# Altium project SC944D.PrjPCB (part 3 of 4)

## Sheet SDEC944-xD_Ethernet.SchDoc: Ethernet
size 393 x 270 mm; CompanyName: Seccom; Address1: 521, rue du capt. François Garbit; Address2: 69440 Mornant; Address3: seccom@seccom.fr; Address4: www.seccom.fr; DocumentNumber: 6; SheetNumber: 6; SheetTotal: 22; PageSetup: Record=PageOptions|CenterHorizontal=True|CenterVertical=True|PrintScale=0.74|XCorrection=1.00|YCorrection=1.00|PrintKind=0|BorderSize=5000000|LeftOffset=0|BottomOffset=0|Orientation=2|PaperLength=1000|PaperWidth=1000|Scale=100|PaperSource=7|PrintQuality=-4|MediaType=1|DitherType=10|PaperKind=A4|PrintScaleMode=1
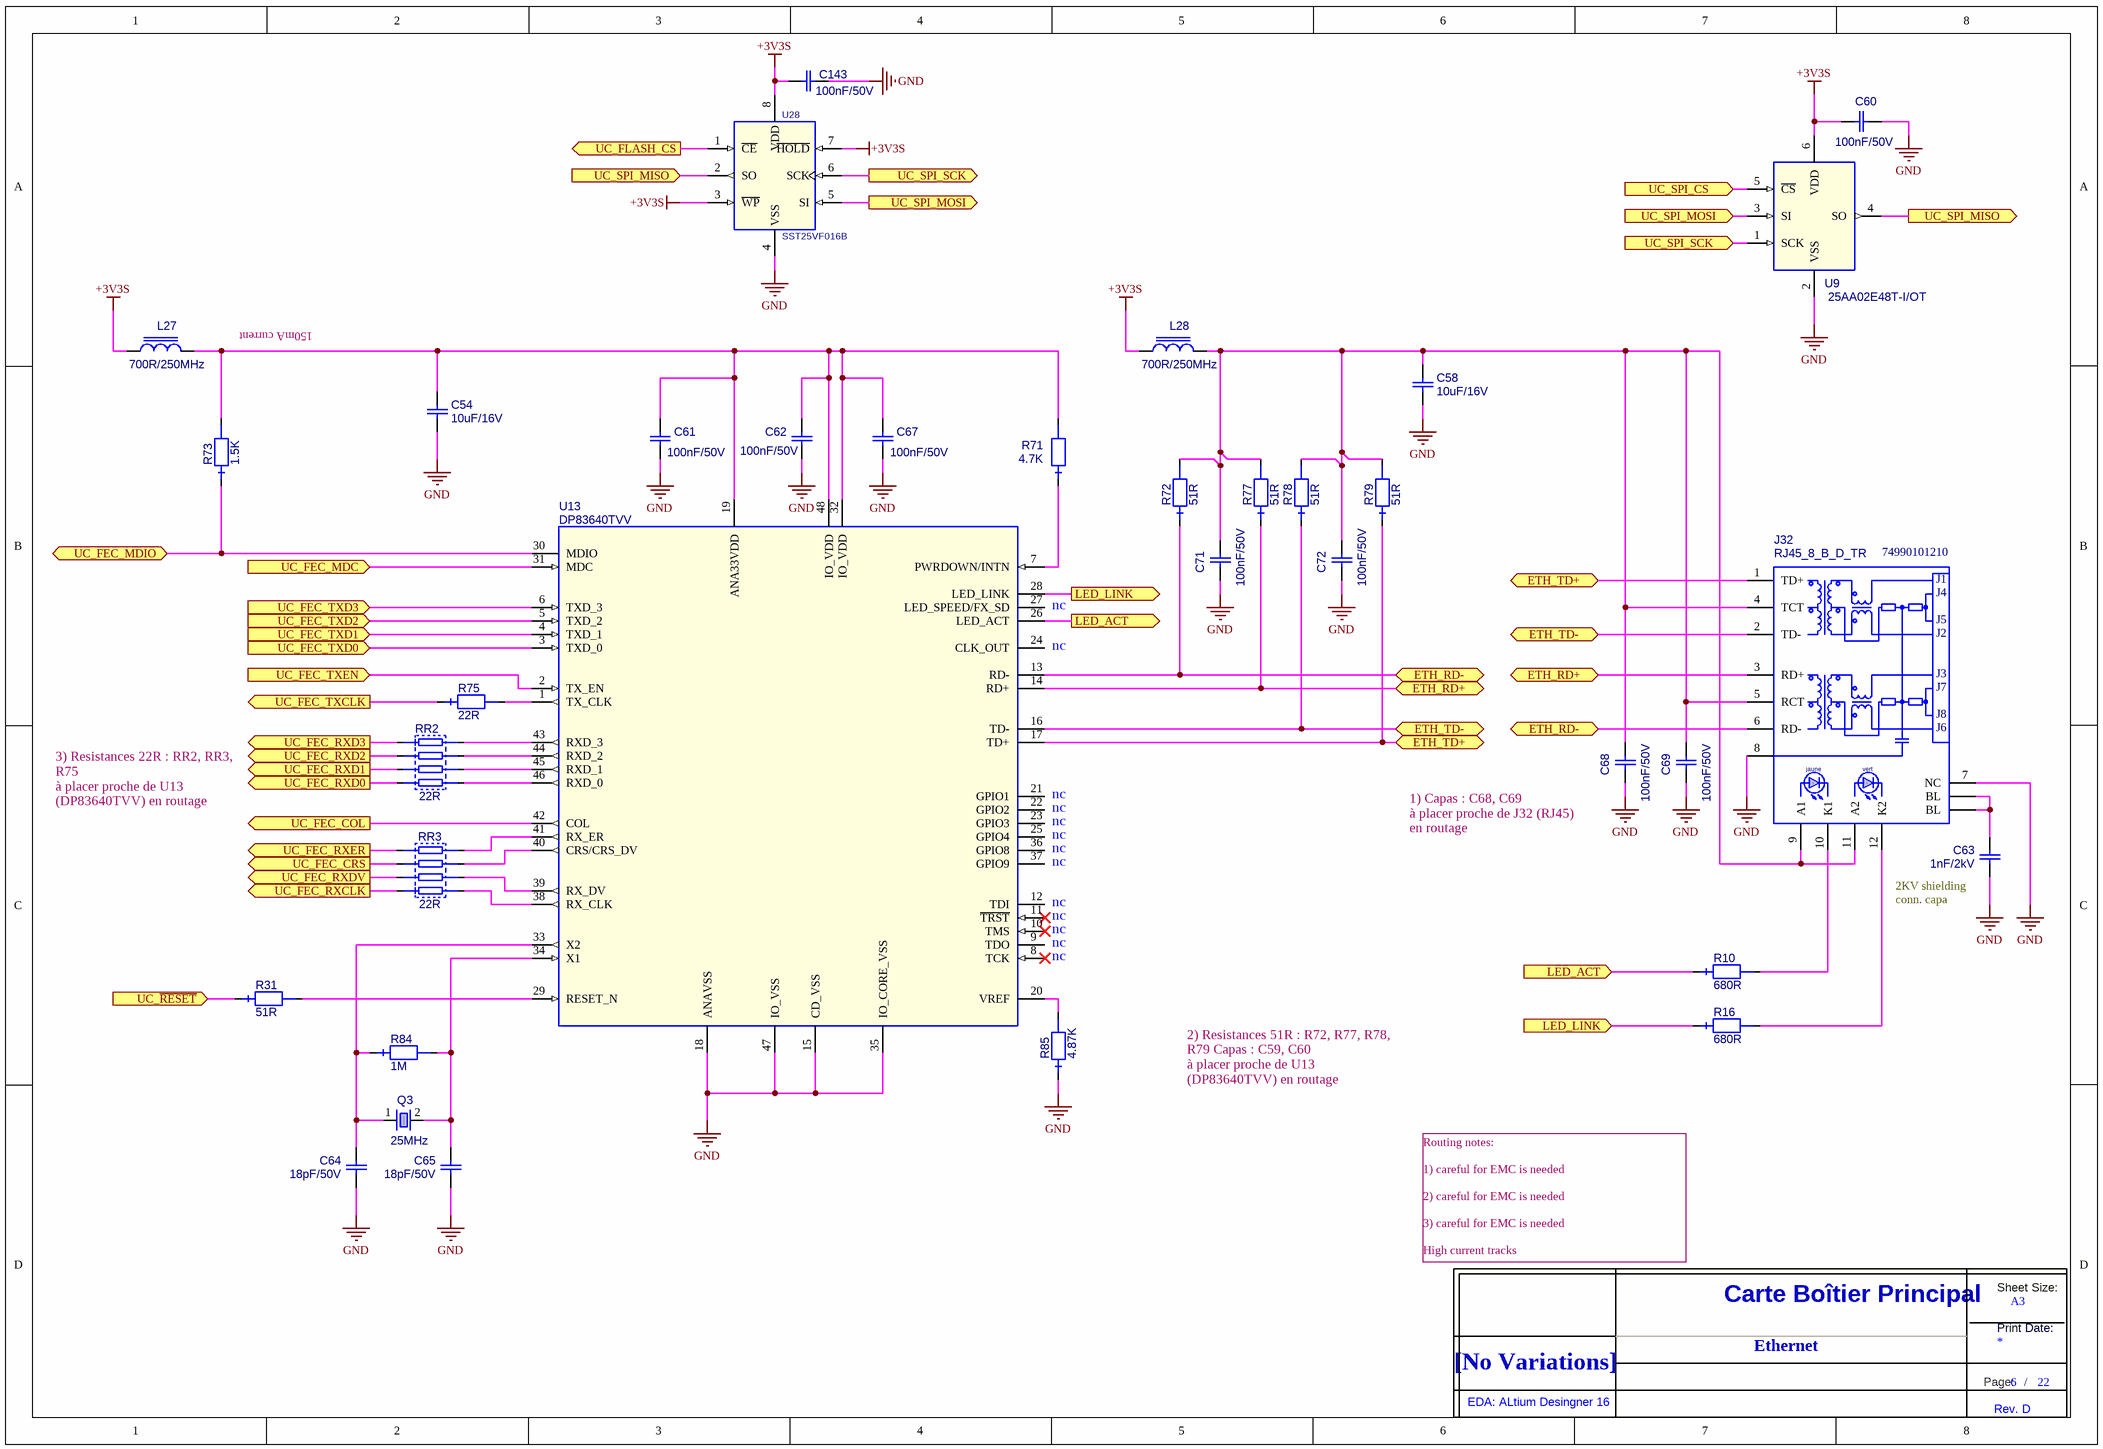
[diagram p5: SDEC944-xD_Ethernet.SchDoc]

### Parts
(Parts that share a designator on the sheet are numbered #1, #2 ... from top to bottom, then left to right.)
C54  value 10uF/16V  [0805_ReflowSoldering_CAP]  (hidden comment: C_0805_X5R_10%_10U-16V)
C58  value 10uF/16V  [0805_ReflowSoldering_CAP]  (hidden comment: C_0805_X5R_10%_10U-16V)
C60  value 100nF/50V  [0603_ReflowSoldering_CAP]  (hidden comment: C_0603_X7R_10%_100N-50V)
C61  value 100nF/50V  [0603_ReflowSoldering_CAP]  (hidden comment: C_0603_X7R_10%_100N-50V)
C62  value 100nF/50V  [0603_ReflowSoldering_CAP]  (hidden comment: C_0603_X7R_10%_100N-50V)
C63  value 1nF/2kV  [1206_ReflowSoldering_CAP]  (hidden comment: C_1206_X7R_10%_1N-2KV)
C64  value 18pF/50V  [0603_ReflowSoldering_CAP]  (hidden comment: C_0603_NPO_5%_18P-50V)
C65  value 18pF/50V  [0603_ReflowSoldering_CAP]  (hidden comment: C_0603_NPO_5%_18P-50V)
C67  value 100nF/50V  [0603_ReflowSoldering_CAP]  (hidden comment: C_0603_X7R_10%_100N-50V)
C68  value 100nF/50V  [0603_ReflowSoldering_CAP]  (hidden comment: C_0603_X7R_10%_100N-50V)
C69  value 100nF/50V  [0603_ReflowSoldering_CAP]  (hidden comment: C_0603_X7R_10%_100N-50V)
C71  value 100nF/50V  [0603_ReflowSoldering_CAP]  (hidden comment: C_0603_X7R_10%_100N-50V)
C72  value 100nF/50V  [0603_ReflowSoldering_CAP]  (hidden comment: C_0603_X7R_10%_100N-50V)
C143  value 100nF/50V  [0603_ReflowSoldering_CAP]  (hidden comment: C_0603_X7R_10%_100N-50V)
J32  value RJ45_8_B_D_TR  Ref Fab: 74990101210  [RJ45_8_B_D_TR_74990101210]  (hidden comment: PORT_ETH_10-100-BT_RJ45-8_B_D_LED_TR_74990101210)
L27  value 700R/250MHz  [0603_ReflowSoldering_CAP]  (hidden comment: IND_FERRITE_0603_742792643)
L28  value 700R/250MHz  [0603_ReflowSoldering_CAP]  (hidden comment: IND_FERRITE_0603_742792643)
Q3  value 25MHz  [QUARTZ_HC49_11.5X5_CMS]  (hidden comment: QUARTZ_HC49/4HSMX_25M)
R10  value 680R  [0603_ReflowSoldering_RES]  (hidden comment: RES_0603_1%_100PPM_680R)
R16  value 680R  [0603_ReflowSoldering_RES]  (hidden comment: RES_0603_1%_100PPM_680R)
R31  value 51R  [0603_ReflowSoldering_RES]  (hidden comment: RES_0603_1%_100PPM_51R)
R71  value 4.7K  [0603_ReflowSoldering_RES]  (hidden comment: RES_0603_1%_100PPM_4.7K)
R72  value 51R  [0603_ReflowSoldering_RES]  (hidden comment: RES_0603_1%_100PPM_51R)
R73  value 1.5K  [0603_ReflowSoldering_RES]  (hidden comment: RES_0603_1%_100PPM_1.5K)
R75  value 22R  [0603_ReflowSoldering_RES]  (hidden comment: RES_0603_1%_100PPM_22R)
R77  value 51R  [0603_ReflowSoldering_RES]  (hidden comment: RES_0603_1%_100PPM_51R)
R78  value 51R  [0603_ReflowSoldering_RES]  (hidden comment: RES_0603_1%_100PPM_51R)
R79  value 51R  [0603_ReflowSoldering_RES]  (hidden comment: RES_0603_1%_100PPM_51R)
R84  value 1M  [0603_ReflowSoldering_RES]  (hidden comment: RES_0603_1%_100PPM_1M)
R85  value 4.87K  [0603_ReflowSoldering_RES]  (hidden comment: RES_0603_1%_100PPM_4.87K)
RR2  value 22R  [ARV241]  (hidden comment: RES_4XR0603_IND_5%_22R*)
RR3  value 22R  [ARV241]  (hidden comment: RES_4XR0603_IND_5%_22R*)
Title_new#6  DNI  (value not drawn)  (graphical)
U9  25AA02E48T-I/OT  [SOT23_6L]
U13  DP83640TVV  [QFP_048_E0,50_7X7MM]
U28  value SST25VF016B  [SOIC_08_E1.27_L200_REFLOWSOLDERING]  (hidden comment: SST25VF016B-50-4I-S2AF)

### Ports
ETH_RD+ (bidir), ETH_RD- (bidir), ETH_TD+ (bidir), ETH_TD- (bidir), LED_ACT (in), LED_ACT (out), LED_LINK (in), LED_LINK (out), UC_FEC_COL (out), UC_FEC_CRS (out), UC_FEC_MDC (in), UC_FEC_MDIO (bidir), UC_FEC_RXCLK (out), UC_FEC_RXD0 (out), UC_FEC_RXD1 (out), UC_FEC_RXD2 (out), UC_FEC_RXD3 (out), UC_FEC_RXDV (out), UC_FEC_RXER (out), UC_FEC_TXCLK (out), UC_FEC_TXD0 (in), UC_FEC_TXD1 (in), UC_FEC_TXD2 (in), UC_FEC_TXD3 (in), UC_FEC_TXEN (in), UC_FLASH_CS (out), UC_SPI_CS (in), UC_SPI_MISO (in), UC_SPI_MISO (out), UC_SPI_MOSI (in), UC_SPI_MOSI (out), UC_SPI_SCK (in), UC_SPI_SCK (out), UC_~{RESET} (in)

### Nets
+3V3S: C60.1 C143.1 L27.1 L28.1 U9.6(VDD) U28.3(~{WP}) U28.7(~{HOLD}) U28.8(VDD)
GND: C54.1 C58.1 C60.2 C61.2 C62.2 C63.1 C64.1 C65.1 C67.2 C68.2 C69.2 C71.2 C72.2 C143.2 J32.7(NC) J32.8 R85.1 U9.2(VSS) U13.15(CD_VSS) U13.18(ANAVSS) U13.35(IO_CORE_VSS) U13.47(IO_VSS) U28.4(VSS)
ETH_RD+: J32.3(RD+) R77.1 U13.14(RD+) ; port ETH_RD+
ETH_RD-: J32.6(RD-) R72.1 U13.13(RD-) ; port ETH_RD-
ETH_TD+: J32.1(TD+) R79.1 U13.17(TD+) ; port ETH_TD+
ETH_TD-: J32.2(TD-) R78.1 U13.16(TD-) ; port ETH_TD-
LED_ACT: R10.1 U13.26(LED_ACT) ; port LED_ACT
LED_LINK: R16.1 U13.28(LED_LINK) ; port LED_LINK
UC_FEC_COL: U13.42(COL) ; port UC_FEC_COL
UC_FEC_CRS: RR3.5 ; port UC_FEC_CRS
UC_FEC_MDC: U13.31(MDC) ; port UC_FEC_MDC
UC_FEC_MDIO: R73.1 U13.30(MDIO) ; port UC_FEC_MDIO
UC_FEC_RXCLK: RR3.1 ; port UC_FEC_RXCLK
UC_FEC_RXD0: RR2.7 ; port UC_FEC_RXD0
UC_FEC_RXD1: RR2.5 ; port UC_FEC_RXD1
UC_FEC_RXD2: RR2.3 ; port UC_FEC_RXD2
UC_FEC_RXD3: RR2.1 ; port UC_FEC_RXD3
UC_FEC_RXDV: RR3.3 ; port UC_FEC_RXDV
UC_FEC_RXER: RR3.7 ; port UC_FEC_RXER
UC_FEC_TXCLK: R75.1 ; port UC_FEC_TXCLK
UC_FEC_TXD0: U13.3(TXD_0) ; port UC_FEC_TXD0
UC_FEC_TXD1: U13.4(TXD_1) ; port UC_FEC_TXD1
UC_FEC_TXD2: U13.5(TXD_2) ; port UC_FEC_TXD2
UC_FEC_TXD3: U13.6(TXD_3) ; port UC_FEC_TXD3
UC_FEC_TXEN: U13.2(TX_EN) ; port UC_FEC_TXEN
UC_FLASH_CS: U28.1(~{CE}) ; port UC_FLASH_CS
UC_~{RESET}: R31.1 ; port UC_~{RESET}
UC_SPI_CS: U9.5(~{CS}) ; port UC_SPI_CS
UC_SPI_MISO: U9.4(SO) U28.2(SO) ; port UC_SPI_MISO
UC_SPI_MOSI: U9.3(SI) U28.5(SI) ; port UC_SPI_MOSI
UC_SPI_SCK: U9.1(SCK) U28.6(SCK) ; port UC_SPI_SCK
NetC54_2: C54.2 C61.1 C62.1 C67.1 L27.2 R71.2 R73.2 U13.19(ANA33VDD) U13.32(IO_VDD) U13.48(IO_VDD)
NetC58_2: C58.2 C68.1 C69.1 C71.1 C72.1 J32.4(TCT) J32.5(RCT) J32.9(A1) J32.11(A2) L28.2 R72.2 R77.2 R78.2 R79.2
NetC63_2: C63.2 J32.FIX1(BL) J32.FIX2(BL)
NetC64_2: C64.2 Q3.1 R84.1 U13.33(X2)
NetC65_2: C65.2 Q3.2 R84.2 U13.34(X1)
NetJ32_10: J32.10(K1) R10.2
NetJ32_12: J32.12(K2) R16.2
NetR31_2: R31.2 U13.29(RESET_N)
NetR71_1: R71.1 U13.7(PWRDOWN/INTN)
NetR75_2: R75.2 U13.1(TX_CLK)
NetR85_2: R85.2 U13.20(VREF)
NetRR2_2: RR2.2 U13.43(RXD_3)
NetRR2_4: RR2.4 U13.44(RXD_2)
NetRR2_6: RR2.6 U13.45(RXD_1)
NetRR2_8: RR2.8 U13.46(RXD_0)
NetRR3_2: RR3.2 U13.38(RX_CLK)
NetRR3_4: RR3.4 U13.39(RX_DV)
NetRR3_6: RR3.6 U13.40(CRS/CRS_DV)
NetRR3_8: RR3.8 U13.41(RX_ER)

Not connected (* = marked no-connect by the designer): U13 8(TCK)* 9(TDO) 10(TMS)* 11(~{TRST})* 12(TDI) 21(GPIO1) 22(GPIO2) 23(GPIO3) 24(CLK_OUT) 25(GPIO4) 27(LED_SPEED/FX_SD) 36(GPIO8) 37(GPIO9)

### Notes on the sheet
- (near L27) 150mA current
- (near U13) nc
- 3) Resistances 22R : RR2, RR3, R75
  à placer proche de U13 (DP83640TVV) en routage
- (near C68) 1) Capas : C68, C69
  à placer proche de J32 (RJ45) en routage
- (near C63) 2KV shielding
  conn. capa
- 2) Resistances 51R : R72, R77, R78, R79 Capas : C59, C60
  à placer proche de U13 (DP83640TVV) en routage
- Routing notes:
  1) careful for EMC is needed
  2) careful for EMC is needed
  3) careful for EMC is needed
  High current tracks
- Ethernet
- (in symbol PORT_ETH_10-100-BT_RJ45-8_B_D_LED_TR_74990101210) J1; J4; J5; J2; J3; J7; J8; J6; jaune; vert
- (in symbol Title_new) Sheet Size:; Carte Boîtier Principal; A3; Print Date:; [No Variations]; Page:; /; EDA: ALtium Desingner 16; Rev. D

### Library data of the parts
C54 C58 = C_0805_X5R_10%_10U-16V: Condensateur céramique, X5R, 10%, CMS 0805, 10uF/16V; Creation: FB (02/10/12); Boitier: 0805; Remarque: {Remarque}; Coeff: 1; Fabricant: Kemet; Ref Fab: C0805C106K4PAC; Verification: *; ComponentLink1URL: O:\_Documentation\Datasheets\Kemet\Condos_Ceramic_CMS.pdf; ComponentLink2URL: o:\_Documentation\Datasheets\_Boitiers\PASSIF_CMS\RC_0805_(2x1,25)_(Schneider).pdf; Config: *; ComponentLink1Description: Datasheet; ComponentLink2Description: Datasheet Boitier
C60-C62 C67-C69 C71 C72 C143 = C_0603_X7R_10%_100N-50V: Condensateur céramique, X7R, 10%, CMS 0603, 100nF/50V; Creation: FB (29/02/12); Boitier: 0603; Remarque: {Remarque}; Fabricant: Kemet; Ref Fab: C0603C104K5RAC; Coeff: 1; ComponentLink1URL: O:\_Documentation\Datasheets\Kemet\Condos_Ceramic_CMS.pdf; ComponentLink2URL: o:\_Documentation\Datasheets\_BOITIERS\PASSIF_CMS\; Config: *; ComponentLink1Description: Datasheet; ComponentLink2Description: Datasheet Boitier; Supplier 1: Farnell; Supplier Part Number 1: 1288255
C63 = C_1206_X7R_10%_1N-2KV: Condensateur céramique, X7R, 10%, CMS 1206; Creation: LJ (29/06/10); Reference: 001425/00; Boitier: 1206; Remarque: {Remarque}; Coeff: 1; Fabricant: Kemet; Ref Fab: C1206C102KGRAC; ComponentLink1URL: O:\_Documentation\Datasheets\Kemet\Condos_Ceramic_HighVoltage_CMS.pdf; ComponentLink2URL: o:\_Documentation\Datasheets\_Boitiers\PASSIF_CMS\; Config: *; ComponentLink1Description: Datasheet; ComponentLink2Description: Datasheet Boitier
C64 C65 = C_0603_NPO_5%_18P-50V: Condensateur céramique, NPO, 5%, CMS 0603, 18pF/50V; Creation: FB (04/07/12); Boitier: 0603; Remarque: {Remarque}; Fabricant: Kemet; Ref Fab: C0603C180J5GAC; Coeff: 1; ComponentLink2URL: o:\_Documentation\Datasheets\_BOITIERS\PASSIF_CMS\; Config: *; ComponentLink1Description: Datasheet; ComponentLink2Description: Datasheet Boitier; Supplier 1: Farnell; Supplier Part Number 1: 1414620
J32 = PORT_ETH_10-100-BT_RJ45-8_B_D_LED_TR_74990101210: Embase RJ45 avec transformateur, 8/8 contacts + Led verte et jaune, blindée, droit, Viso 1.5kV; Creation: JPL (05/07/12); Coeff: 1; Fabricant: Wurth Electronik; Boitier: RJ45_8_B_D_TR; Config: *; ComponentLink1Description: Datasheet; ComponentLink2Description: Datasheet Boitier
L27 L28 = IND_FERRITE_0603_742792643: Inductance à ferrite multicouches CMS, imp=700R@250MHz, +/-25%, Rdc=350mR, I=400mA; Creation: PDP (02/08/12); Boitier: 0603; Coeff: 1; Fabricant: Wurth Elektronik; ComponentLink1URL: o:\_Documentation\Datasheets\Murata\Ferrite_BLM21P.pdf; Config: *; ComponentLink1Description: Datasheet; ComponentLink2Description: Datasheet Boitier; Ref Fab: 742792643; Supplier 1: Farnell; Supplier Part Number 1: 1800349
Q3 = QUARTZ_HC49/4HSMX_25M: Quartz CMS série HCM49 (équiv HC49/US), -10/+60°C, +/-30ppm, 18pF; Creation: LJ (11/03/09); Reference: 000495/00; Fabricant: Citizen; Ref Fab: HCM49 25.000MABJ-UT; Coeff: 1; Verification: *; Boitier: HC49/4HSMX; Remarque: *; ComponentLink1URL: O:\_Documentation\Datasheets\Citizen\Quartz_HC49-US_HCM49.pdf; ComponentLink2URL: o:\_Documentation\Datasheets\_BOITIERS\; Config: *; ComponentLink1Description: Datasheet; ComponentLink2Description: Datasheet Boitier; Supplier 1: Farnell; Supplier 2: Mouser; Supplier Part Number 1: 1457105; Supplier Part Number 2: 695-HCM49-25-U
R10 R16 = RES_0603_1%_100PPM_680R: Résistance, 0.100W, 1%, 100ppm, 75V, 680R; Creation: FB (02/08/12); Boitier: 0603; Remarque: {Remarque}; Fabricant: Vishay; Ref Fab: CRCW0603680RFKEA; Coeff: 1; Verification: *; ComponentLink1URL: O:\_Documentation\Datasheets\Vishay\Resistances_D-CRCWe3.pdf; ComponentLink2URL: o:\_Documentation\Datasheets\_BOITIERS\PASSIF_CMS\; Config: *; ComponentLink1Description: Datasheet; ComponentLink2Description: Datasheet Boitier; Supplier 1: Farnell; Supplier Part Number 1: 1469834; Supplier 2: Mouser; Supplier Part Number 2: 71-CRCW0603-680-E3
R31 R72 R77-R79 = RES_0603_1%_100PPM_51R: Résistance, 0.100W, 1%, 100ppm, 75V, 51R; Creation: JPL (05/07/12); Boitier: 0603; Remarque: {Remarque}; Fabricant: Vishay; Ref Fab: CRCW060351R0FKEA; Coeff: 1; Verification: *; ComponentLink1URL: O:\_Documentation\Datasheets\Vishay\Resistances_D-CRCWe3.pdf; ComponentLink2URL: o:\_Documentation\Datasheets\_BOITIERS\PASSIF_CMS\; Config: *; ComponentLink1Description: Datasheet; ComponentLink2Description: Datasheet Boitier; Supplier 1: Farnell; Supplier 2: Mouser; Supplier Part Number 1: 1652889; Supplier Part Number 2: 71-CRCW0603-51-E3
R71 = RES_0603_1%_100PPM_4.7K: Résistance, 0.100W, 1%, 100ppm, 75V, 4.7K; Creation: JPL (05/07/12); Boitier: 0603; Remarque: {Remarque}; Fabricant: Vishay; Ref Fab: CRCW06034K70FKEA; Coeff: 1; Verification: *; ComponentLink1URL: O:\_Documentation\Datasheets\Vishay\Resistances_D-CRCWe3.pdf; ComponentLink2URL: o:\_Documentation\Datasheets\_BOITIERS\PASSIF_CMS\; Config: *; ComponentLink1Description: Datasheet; ComponentLink2Description: Datasheet Boitier; Supplier 1: Farnell; Supplier 2: RadioSpares; Supplier Part Number 1: 1469807; Supplier Part Number 2: 6790484
R73 = RES_0603_1%_100PPM_1.5K: Résistance, 0.100W, 1%, 100ppm, 75V, 1.5K; Creation: JPL (05/07/12); Boitier: 0603; Remarque: {Remarque}; Fabricant: Vishay; Ref Fab: CRCW06031K50FKEA; Coeff: 1; Verification: *; ComponentLink1URL: O:\_Documentation\Datasheets\Vishay\Resistances_D-CRCWe3.pdf; ComponentLink2URL: o:\_Documentation\Datasheets\_BOITIERS\PASSIF_CMS\; Config: *; ComponentLink1Description: Datasheet; ComponentLink2Description: Datasheet Boitier; Supplier 1: Farnell; Supplier 2: RadioSpares; Supplier Part Number 1: 1469743; Supplier Part Number 2: 6789908
R75 = RES_0603_1%_100PPM_22R: Résistance, 0.100W, 1%, 100ppm, 75V, 22R; Creation: FB (05/07/12); Boitier: 0603; Remarque: {Remarque}; Fabricant: Vishay; Ref Fab: CRCW060322R0FKEA; Coeff: 1; Verification: *; ComponentLink1URL: O:\_Documentation\Datasheets\Vishay\Resistances_D-CRCWe3.pdf; ComponentLink2URL: o:\_Documentation\Datasheets\_BOITIERS\PASSIF_CMS\; Config: *; ComponentLink1Description: Datasheet; ComponentLink2Description: Datasheet Boitier; Supplier 1: Farnell; Supplier Part Number 1: 1469781
R84 = RES_0603_1%_100PPM_1M: Résistance, 0.100W, 1%, 100ppm, 75V, 1M; Creation: FB (04/07/12); Boitier: 0603; Remarque: {Remarque}; Fabricant: Vishay; Ref Fab: CRCW06031M00FKEA; Coeff: 1; Verification: *; ComponentLink1URL: O:\_Documentation\Datasheets\Vishay\Resistances_D-CRCWe3.pdf; ComponentLink2URL: o:\_Documentation\Datasheets\_BOITIERS\PASSIF_CMS\; Config: *; ComponentLink1Description: Datasheet; ComponentLink2Description: Datasheet Boitier; Supplier 1: Farnell; Supplier Part Number 1: 1469746
R85 = RES_0603_1%_100PPM_4.87K: Résistance, 0.100W, 1%, 100ppm, 75V, 4.87K; Creation: JPL (05/07/12); Boitier: 0603; Remarque: {Remarque}; Fabricant: Vishay; Ref Fab: CRCW06034K87FKEA; Coeff: 1; Verification: *; ComponentLink1URL: O:\_Documentation\Datasheets\Vishay\Resistances_D-CRCWe3.pdf; ComponentLink2URL: o:\_Documentation\Datasheets\_BOITIERS\PASSIF_CMS\; Config: *; ComponentLink1Description: Datasheet; ComponentLink2Description: Datasheet Boitier; Supplier 1: Farnell; Supplier 2: RadioSpares; Supplier Part Number 1: 1692529; Supplier Part Number 2: 6790481
RR2 RR3 = RES_4XR0603_IND_5%_22R*: Réseau de 4 résistances 0603 individuels, 63mW, 5%, CONCAVE / CONVEXE, CMS 1206; Creation: CHD; Reference: 001805/00; Boitier: ARx241; Remarque: {Remarque}; Verification: LJ (07/02/12); Coeff: 1; Fabricant: Yageo; Ref Fab: YC164-JR-0722RL; ComponentLink1URL: o:\_Documentation\Datasheets\Phycomp\ARC-ARV241-242.PDF; ComponentLink2URL: o:\_Documentation\Datasheets\_BOITIERS\; Config: *; ComponentLink1Description: Datasheet; ComponentLink2Description: Datasheet Boitier; Supplier 1: Farnell; Supplier Part Number 1: 9234411
Title_new#6 = Title_new
U9 = 25AA02E48T-I/OT: EEPROM, avec identifiant EUI-48 (adresse MAC), 2kbits, Vs=1.8~5.5V, 10MHz, CMS; Creation: CHD(10/03/09); Verification: LJ; Reference: 000492/00; Coeff: 1; Fabricant: Microchip; Boitier: SOT23_6L; Remarque: *; ComponentLink1URL: o:\_Documentation\Datasheets\MicroChip\25AA02E48.pdf; ComponentLink2URL: o:\_Documentation\Datasheets\_Boitiers\ACTIF_CMS\SOT & TSOT\SOT23_6_(Schneider).pdf; Config: *; ComponentLink1Description: Datasheet; ComponentLink2Description: Datasheet Boitier; Ref Fab: 25AA02E48T-I/OT; Value: 25AA02E48T-I/OT
U13 = DP83640TVV: DP83640 Precision PHYTER - IEEE 1588 Precision Time Protocol Transceiver; Creation: FB (05/07/12); Boitier: LQFP48_e0.50_7x7mm; Remarque: {Remarque}; Coeff: 1; Fabricant: National Semiconductor; Ref Fab: DP83640TVV; ComponentLink1Description: Datasheet; ComponentLink1URL: o:\_Documentation\Datasheets\; ComponentLink2Description: Datasheet Boitier; ComponentLink2URL: o:\_Documentation\Datasheets\_BOITIERS\; Supplier 1: Farnell; Supplier Part Number 1: 1850292; Value: DP83640TVV
U28 = SST25VF016B-50-4I-S2AF: Mémoire Flash SPI, 2MBit, 50MHz, Vs=2.7~3.6V, -40/+85°C, CMS; Creation: PDP (23/04/13); Boitier: SO8_L200; Coeff: 1; Fabricant: Microchip; Verification: *; ComponentLink1URL: O:\_Documentation\Datasheets\MicroChip\SST25VF016B.pdf; ComponentLink2URL: O:\_Documentation\Datasheets\MicroChip\SST25VF016B.pdf; ComponentLink1Description: Datasheet; ComponentLink2Description: Datasheet Boitier; Ref Fab: SST25VF016B-50-4I-S2AF; Supplier 1: Farnell; Supplier Part Number 1: 1368695; Supplier 2: Mouser; Supplier Part Number 2: 579-25VF016B5IS2AF

## Sheet SDEC944-xD_Liaison_IHM.SchDoc: Liaison IHM
size 393 x 270 mm; CompanyName: Seccom; Address1: 521, rue du capt. François Garbit; Address2: 69440 Mornant; Address3: seccom@seccom.fr; Address4: www.seccom.fr; DocumentNumber: 8; SheetNumber: 8; SheetTotal: 22; PageSetup: Record=PageOptions|CenterHorizontal=True|CenterVertical=True|PrintScale=0.74|XCorrection=1.00|YCorrection=1.00|PrintKind=0|BorderSize=5000000|LeftOffset=0|BottomOffset=0|Orientation=2|PaperLength=1000|PaperWidth=1000|Scale=100|PaperSource=7|PrintQuality=-4|MediaType=1|DitherType=10|PaperKind=A4|PrintScaleMode=1
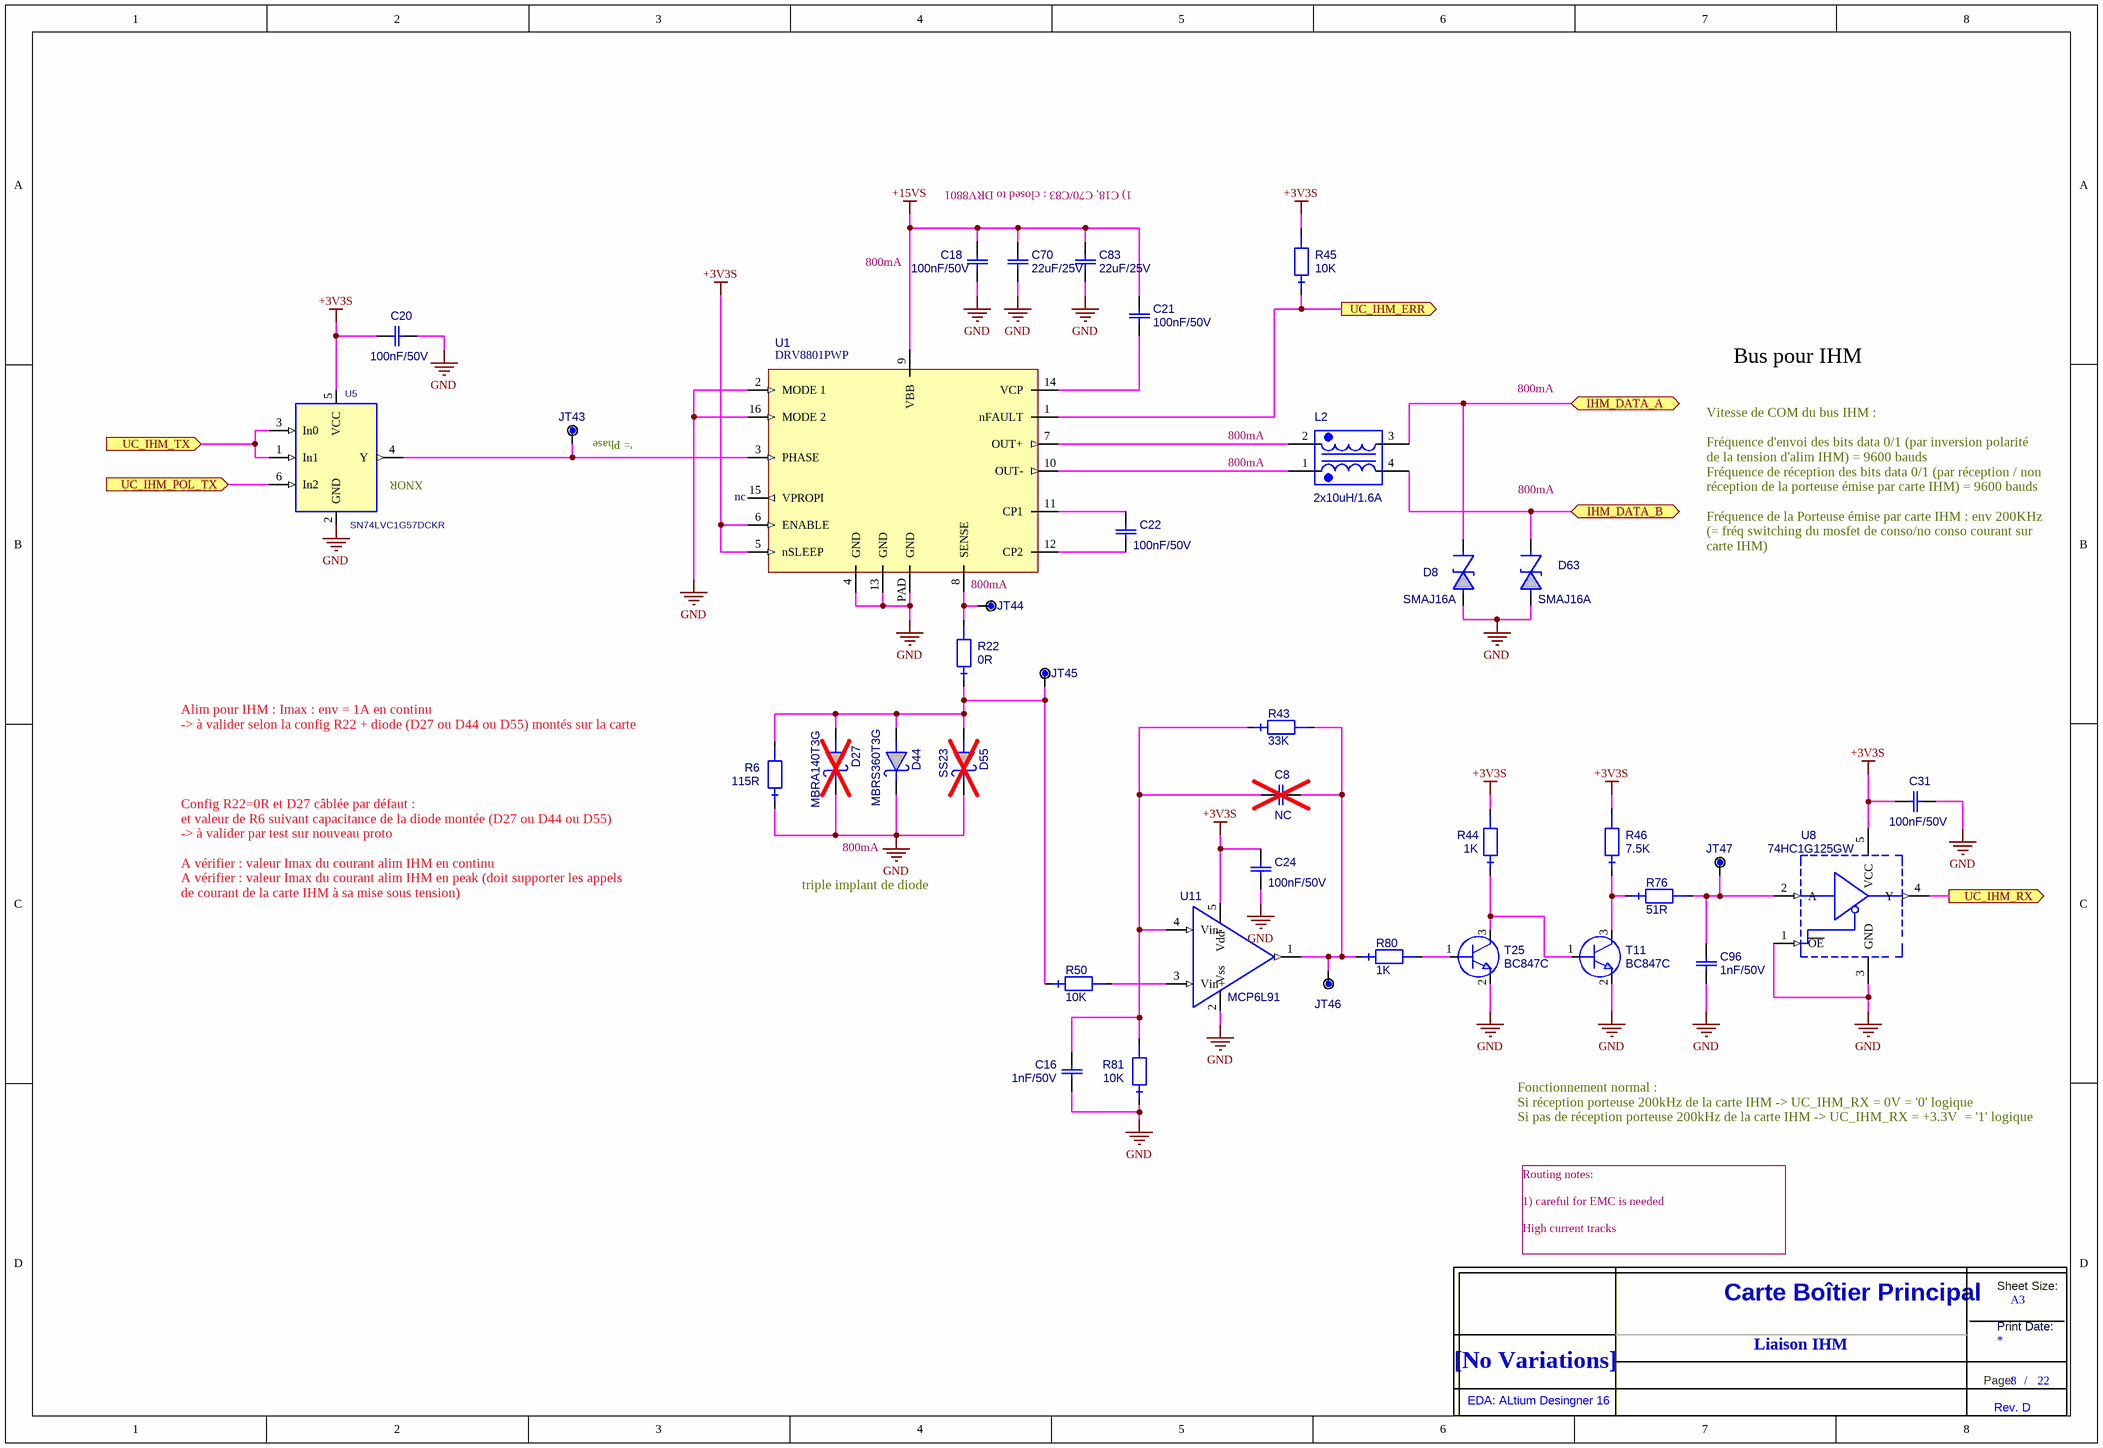
[diagram p6: SDEC944-xD_Liaison_IHM.SchDoc]

### Parts
(Parts that share a designator on the sheet are numbered #1, #2 ... from top to bottom, then left to right.)
C8  value NC  [0603_ReflowSoldering_CAP]  (hidden comment: C_0603_NC)  (no BOM)
C16  value 1nF/50V  [0603_ReflowSoldering_CAP]  (hidden comment: C_0603_NPO_5%_1N-50V)
C18  value 100nF/50V  [0603_ReflowSoldering_CAP]  (hidden comment: C_0603_X7R_10%_100N-50V)
C20  value 100nF/50V  [0603_ReflowSoldering_CAP]  (hidden comment: C_0603_X7R_10%_100N-50V)
C21  value 100nF/50V  [0603_ReflowSoldering_CAP]  (hidden comment: C_0603_X7R_10%_100N-50V)
C22  value 100nF/50V  [0603_ReflowSoldering_CAP]  (hidden comment: C_0603_X7R_10%_100N-50V)
C24  value 100nF/50V  [0603_ReflowSoldering_CAP]  (hidden comment: C_0603_X7R_10%_100N-50V)
C31  value 100nF/50V  [0603_ReflowSoldering_CAP]  (hidden comment: C_0603_X7R_10%_100N-50V)
C70  value 22uF/25V  [1206_ReflowSoldering_CAP]  (hidden comment: C_1206_X5R_20%_22U-25V)
C83  value 22uF/25V  [1206_ReflowSoldering_CAP]  (hidden comment: C_1206_X5R_20%_22U-25V)
C96  value 1nF/50V  [0603_ReflowSoldering_CAP]  (hidden comment: C_0603_NPO_5%_1N-50V)
D8  SMAJ16A  [DO214AC-SMA-P_ReflowSoldering]
D27  MBRA140T3G  [DO214AC-SMA-P_ReflowSoldering]  (no BOM)
D44  MBRS360T3G  [DO214AB-SMC-P_ReflowSoldering]
D55  SS23  [DO214AA-SMB-P_ReflowSoldering]  (no BOM)
D63  SMAJ16A  [DO214AC-SMA-P_ReflowSoldering]
JT43  POINT_TEST_PAD_40MIL  [PAD_CL5_E40X40Y17D]  (value not drawn)  (no BOM)
JT44  POINT_TEST_PAD_40MIL  [PAD_CL5_E40X40Y17D]  (value not drawn)  (no BOM)
JT45  POINT_TEST_PAD_40MIL  [PAD_CL5_E40X40Y17D]  (value not drawn)  (no BOM)
JT46  POINT_TEST_PAD_40MIL  [PAD_CL5_E40X40Y17D]  (value not drawn)  (no BOM)
JT47  POINT_TEST_PAD_40MIL  [PAD_CL5_E40X40Y17D]  (value not drawn)  (no BOM)
L2  value 2x10uH/1.6A  [SELF_WE-SL2_9.2x6]  (hidden comment: IND_FERRITE_WE-SL2_2X10UH)
R6  value 115R  [0603_ReflowSoldering_RES]  (hidden comment: RES_0603_1%_100PPM_115R)
R22  value 0R  [0603_ReflowSoldering_RES]  (hidden comment: RES_0603_1%_100PPM_0R)
R43  value 33K  [0603_ReflowSoldering_RES]  (hidden comment: RES_0603_1%_100PPM_33K)
R44  value 1K  [0603_ReflowSoldering_RES]  (hidden comment: RES_0603_1%_100PPM_1K)
R45  value 10K  [0603_ReflowSoldering_RES]  (hidden comment: RES_0603_1%_100PPM_10K)
R46  value 7.5K  [0603_ReflowSoldering_RES]  (hidden comment: RES_0603_1%_100PPM_7.5K)
R50  value 10K  [0603_ReflowSoldering_RES]  (hidden comment: RES_0603_1%_100PPM_10K)
R76  value 51R  [0603_ReflowSoldering_RES]  (hidden comment: RES_0603_1%_100PPM_51R)
R80  value 1K  [0603_ReflowSoldering_RES]  (hidden comment: RES_0603_1%_100PPM_1K)
R81  value 10K  [0603_ReflowSoldering_RES]  (hidden comment: RES_0603_1%_100PPM_10K)
T11  BC847C  [SOT23_3L_ReflowSoldering]
T25  BC847C  [SOT23_3L_ReflowSoldering]
Title_new#7  DNI  (value not drawn)  (graphical)
U1  DRV8801PWP  [HTSSOP_016_E0,65_L4,4MM_PWP]
U5  value SN74LVC1G57DCKR  [SC70_6]  (hidden comment: 74LVC1G57DCKR)
U8  74HC1G125GW  [SOT353]
U11  value MCP6L91  [SOT23_5L]  (hidden comment: MCP6L91T-E/OT)

### Ports
IHM_DATA_A (bidir), IHM_DATA_B (bidir), UC_IHM_ERR (out), UC_IHM_POL_TX (in), UC_IHM_RX (out), UC_IHM_TX (in)

### Nets
+3V3S: C20.1 C24.1 C31.1 R44.2 R45.2 R46.2 U1.5(nSLEEP) U1.6(ENABLE) U5.5(VCC) U8.5(VCC) U11.5(Vdd)
+15VS: C18.1 C21.1 C70.2 C83.2 U1.9(VBB)
GND: C16.1 C18.2 C20.2 C24.2 C31.2 C70.1 C83.1 C96.1 D8.A D27.K D44.K D55.K D63.A R6.1 R81.1 T11.2(E) T25.2(E) U1.2(MODE_1) U1.4(GND) U1.13(GND) U1.16(MODE_2) U1.PAD(GND) U5.2(GND) U8.1 U8.3(GND) U11.2(Vss)
IHM_DATA_A: D8.K L2.3 ; port IHM_DATA_A
IHM_DATA_B: D63.K L2.4 ; port IHM_DATA_B
UC_IHM_ERR: R45.1 U1.1(nFAULT) ; port UC_IHM_ERR
UC_IHM_POL_TX: U5.6(In2) ; port UC_IHM_POL_TX
UC_IHM_RX: U8.4(Y) ; port UC_IHM_RX
UC_IHM_TX: U5.1(In1) U5.3(In0) ; port UC_IHM_TX
NetC8_1: C8.1 JT46.1 R43.2 R80.1 U11.1(OUTPUT)
NetC8_2: C8.2 C16.2 R43.1 R81.2 U11.4(Vin-)
NetC21_2: C21.2 U1.14(VCP)
NetC22_1: C22.1 U1.11(CP1)
NetC22_2: C22.2 U1.12(CP2)
NetC96_2: C96.2 JT47.1 R76.2 U8.2(A)
NetD27_A: D27.A D44.A D55.A JT45.1 R6.2 R22.1 R50.1
NetJT43_1: JT43.1 U1.3(PHASE) U5.4(Y)
NetJT44_1: JT44.1 R22.2 U1.8(SENSE)
NetL2_1: L2.1 U1.10(OUT-)
NetL2_2: L2.2 U1.7(OUT+)
NetR44_1: R44.1 T11.1(B) T25.3(C)
NetR46_1: R46.1 R76.1 T11.3(C)
NetR50_2: R50.2 U11.3(Vin+)
NetR80_2: R80.2 T25.1(B)

Not connected (* = marked no-connect by the designer): U1 15(VPROPI)

### Notes on the sheet
- 1) C18, C70/C83 : closed to DRV8801
- 800mA
- Bus pour IHM
- (near JT43) '= Phase
- (near U5) XNOR
- (near U1) nc
- Vitesse de COM du bus IHM :
  Fréquence d'envoi des bits data 0/1 (par inversion polarité de la tension d'alim IHM) = 9600 bauds
  Fréquence de réception des bits data 0/1 (par réception / non réception de la porteuse émise par carte IHM) = 9600 bauds
  Fréquence de la Porteuse émise par carte IHM : env 200KHz (= fréq switching du mosfet de conso/no conso courant sur carte IHM)
- Alim pour IHM : Imax : env = 1A en continu
  -> à valider selon la config R22 + diode (D27 ou D44 ou D55) montés sur la carte
- Config R22=0R et D27 câblée par défaut :
  et valeur de R6 suivant capacitance de la diode montée (D27 ou D44 ou D55)
  -> à valider par test sur nouveau proto
  A vérifier : valeur Imax du courant alim IHM en continu
  A vérifier : valeur Imax du courant alim IHM en peak (doit supporter les appels de courant de la carte IHM à sa mise sous tension)
- triple implant de diode
- Fonctionnement normal :
  Si réception porteuse 200kHz de la carte IHM -> UC_IHM_RX = 0V = '0' logique
  Si pas de réception porteuse 200kHz de la carte IHM -> UC_IHM_RX = +3.3V  = '1' logique
- Routing notes:
  1) careful for EMC is needed
  High current tracks
- Liaison IHM
- (in symbol Title_new) Sheet Size:; Carte Boîtier Principal; A3; Print Date:; [No Variations]; Page:; /; EDA: ALtium Desingner 16; Rev. D

### Library data of the parts
C8 = C_0603_NC: Condensateur, CMS 0603, NC; Creation: PDP (30/08/12); Boitier: 0603; Coeff: 1; ComponentLink2URL: o:\_Documentation\Datasheets\_BOITIERS\PASSIF_CMS\; ComponentLink2Description: Datasheet Boitier
C16 C96 = C_0603_NPO_5%_1N-50V: Condensateur céramique, NPO, 5%, CMS 0603; Creation: LJ; Reference: 001809/00; Boitier: 0603; Remarque: {Remarque}; Coeff: 1; Fabricant: AVX; Ref Fab: 06035A102JAT2A; ComponentLink1URL: o:\_Documentation\Datasheets\BC_Components\Condo_CMS_NPO-X7R-Y5V.pdf; ComponentLink2URL: o:\_Documentation\Datasheets\_BOITIERS\PASSIF_CMS\; Config: *; ComponentLink1Description: Datasheet; ComponentLink2Description: Datasheet Boitier; Supplier 1: Mouser; Supplier Part Number 1: 581-06035A102J
C18 C20-C22 C24 C31 = C_0603_X7R_10%_100N-50V: as C60 on sheet SDEC944-xD_Ethernet; ComponentLink1URL: O:\_Documentation\Datasheets\Kemet\Condos_Ceramic_CMS.pdf; ComponentLink2URL: o:\_Documentation\Datasheets\_BOITIERS\PASSIF_CMS\; Config: *; ComponentLink1Description: Datasheet; ComponentLink2Description: Datasheet Boitier; Supplier 1: Farnell; Supplier Part Number 1: 1288255
C70 C83 = C_1206_X5R_20%_22U-25V: Condensateur céramique, X5R, 20%, CMS 1206, 22uF/25V; Creation: ZA (18/12/13); Reference: /01; Boitier: 1206; Remarque: {Remarque}; Fabricant: TDK; Coeff: 1; Ref Fab: C3216X5R1E226M160AB; Verification: *; ComponentLink1URL: O:\_Documentation\Datasheets\TDK\general_B11.pdf; ComponentLink2URL: o:\_Documentation\Datasheets\_BOITIERS\PASSIF_CMS\; ComponentLink1Description: Datasheet; ComponentLink2Description: Datasheet Boitier; Supplier 1: Farnell; Supplier Part Number 1: 2354129; Supplier 2: Mouser; Supplier Part Number 2: 810-C3216X5R1E226M
D8 D63 = SMAJ16A: Diode Transil/TVS unidirectionnelle (A), Transzorb, 400W, 16V, CMS; Creation: ZA (29/07/13); Boitier: DO214AC/SMA; Remarque: {Remarque}; Coeff: 1; Fabricant: Bourns; ComponentLink1URL: o:\_Documentation\Datasheets\Bourns\SMAJ-74970.pdf; ComponentLink2URL: o:\_Documentation\Datasheets\_BOITIERS\ACTIF_CMS\SMx\SMB_(Schneider).lnk; Config: *; ComponentLink1Description: Datasheet; ComponentLink2Description: Datasheet Boitier; Ref Fab: SMAJ16A; Supplier 1: Farnell; Supplier Part Number 1: 1843352; Supplier 2: Mouser; Supplier Part Number 2: 652-SMAJ16A; Value: SMAJ16A
D27 = MBRA140T3G: Diode Schottky, Vrrm=40V, If=1A, Vf=0.55V@1A, CMS; Creation: PDP (31/08/12); Boitier: DO214AC/SMA; Fabricant: ON Semiconductor; Coeff: 1; Ref Fab: MBRA140T3G; ComponentLink1URL: O:\_Documentation\Datasheets\ON_Semiconductors\MBRA140T3-D.PDF; ComponentLink2URL: O:\_Documentation\Datasheets\ON_Semiconductors\MBRA140T3-D.PDF; Config: *; ComponentLink1Description: Datasheet; ComponentLink2Description: Datasheet Boitier; Supplier 1: Farnell; Supplier Part Number 1: 9555986; Supplier 2: Mouser; Supplier Part Number 2: 863-MBRA140T3G; Value: MBRA140T3G
D44 = MBRS360T3G: Diode Schottky, Vrrm=60V, If=3A, Vf=0.74V, -65 à +175°C, CMS; Creation: ZA (16/04/13); Boitier: DO214AB/SMC; Fabricant: ON Semiconductor; Coeff: 1; Ref Fab: MBRS360T3G; ComponentLink1URL: O:\_Documentation\Datasheets\ON_Semiconductors\MBRS360T3G_NRVBS360T3G.PDF; ComponentLink2URL: O:\_Documentation\Datasheets\ON_Semiconductors\MBRS360T3G_NRVBS360T3G.PDF; Config: *; ComponentLink1Description: Datasheet; ComponentLink2Description: Datasheet Boitier; Supplier 1: Farnell; Supplier Part Number 1: 9556940; Supplier 2: Mouser; Supplier Part Number 2: 863-MBRS360T3G; Value: MBRS360T3G
D55 = SS23: Diode Schottky, Vrrm=30V, If=2A, Vf=0.5V, -65 à +125°C, CMS; Creation: ZA (16/04/13); Boitier: DO214AA/SMB; Fabricant: Fairchild; Coeff: 1; Verification: *; Ref Fab: SS23; ComponentLink1URL: o:\_Documentation\Datasheets\Fairchild\SS22-S210.pdf; ComponentLink2URL: o:\_Documentation\Datasheets\Fairchild\SS22-S210.pdf; Config: *; ComponentLink1Description: Datasheet; ComponentLink2Description: Datasheet Boitier; Supplier 1: Farnell; Supplier Part Number 1: 9843795; Supplier 2: Mouser; Supplier Part Number 2: 512-SS23; Value: SS23
JT43-JT47 = POINT_TEST_PAD_40MIL: Point de test sur CI, pad de diamètre 1.016mm (40mils); Creation: FB (04/10/12); Remarque: {Remarque}; Coeff: 1; Value: POINT_TEST; Config: *; ComponentLink1Description: Datasheet; ComponentLink2Description: Datasheet Boitier
L2 = IND_FERRITE_WE-SL2_2X10UH: Filtre double ferrite, 2x10uH, 42Vac/80Vdc, 1.6A, serie WE-SL2, -40/+125°C, CMS; Creation: FB (19/03/12); Boitier: WE-SL2_9.2x6_h5mm; Coeff: 1; Fabricant: Wurth Elektronik; Ref Fab: 744226; ComponentLink1URL: O:\_Documentation\Datasheets\Wurth_Elektronik\744226.pdf; ComponentLink2URL: o:\_Documentation\Datasheets\_BOITIERS\; Config: *; ComponentLink1Description: Datasheet; ComponentLink2Description: Datasheet Boitier; Supplier Part Number 1: 1636269; Supplier 1: Farnell; Supplier 2: Radiospares; Supplier Part Number 2: 3675045
R6 = RES_0603_1%_100PPM_115R: Résistance, 0.100W, 1%, 100ppm, 75V, 115R; Creation: PDP (03/10/12); Boitier: 0603; Remarque: {Remarque}; Fabricant: Vishay; Ref Fab: CRCW0603115RFKEA; Coeff: 1; Verification: *; ComponentLink1URL: O:\_Documentation\Datasheets\Vishay\Resistances_D-CRCWe3.pdf; ComponentLink2URL: o:\_Documentation\Datasheets\_BOITIERS\PASSIF_CMS\; Config: *; ComponentLink1Description: Datasheet; ComponentLink2Description: Datasheet Boitier; Supplier 1: Mouser; Supplier Part Number 1: 71-CRCW0603-115-E3; Supplier 2: Farnell; Supplier Part Number 2: 2141284
R22 = RES_0603_1%_100PPM_0R: Résistance, 0.100W, 1%, 100ppm, 75V, 0R; Creation: FB (04/07/12); Boitier: 0603; Fabricant: Vishay; Ref Fab: CRCW06030000Z0EA; Coeff: 1; Remarque: {Remarque}; Verification: *; ComponentLink1URL: O:\_Documentation\Datasheets\Vishay\Resistances_D-CRCWe3.pdf; ComponentLink2URL: o:\_Documentation\Datasheets\_BOITIERS\PASSIF_CMS\; Config: *; ComponentLink1Description: Datasheet; ComponentLink2Description: Datasheet Boitier; Supplier 1: Farnell; Supplier Part Number 1: 1469739
R43 = RES_0603_1%_100PPM_33K: Résistance, 0.100W, 1%, 100ppm, 75V, 33K; Creation: JPL (05/07/12); Boitier: 0603; Remarque: {Remarque}; Coeff: 1; Fabricant: Vishay; Ref Fab: CRCW060333K0FKEA; Verification: *; ComponentLink1URL: O:\_Documentation\Datasheets\Vishay\Resistances_D-CRCWe3.pdf; ComponentLink2URL: o:\_Documentation\Datasheets\_BOITIERS\PASSIF_CMS\; Config: *; ComponentLink1Description: Datasheet; ComponentLink2Description: Datasheet Boitier; Supplier 1: Farnell; Supplier Part Number 1: 1469801; Supplier 2: RadioSpares; Supplier Part Number 2: 6790232
R44 R80 = RES_0603_1%_100PPM_1K: Résistance, 0.100W, 1%, 100ppm, 75V, 1K; Creation: JPL (05/07/12); Boitier: 0603; Remarque: {Remarque}; Fabricant: Vishay; Ref Fab: CRCW06031K00FKEA; Coeff: 1; Verification: *; ComponentLink1URL: O:\_Documentation\Datasheets\Vishay\Resistances_D-CRCWe3.pdf; ComponentLink2URL: o:\_Documentation\Datasheets\_BOITIERS\PASSIF_CMS\; Config: *; ComponentLink1Description: Datasheet; ComponentLink2Description: Datasheet Boitier; Supplier 1: Farnell; Supplier 2: RadioSpares; Supplier Part Number 1: 1469740; Supplier Part Number 2: 6789875
R45 = RES_0603_1%_100PPM_10K: Résistance, 0.100W, 1%, 100ppm, 75V, 10K; Creation: JPL (05/07/12); Boitier: 0603; Remarque: {Remarque}; Fabricant: Vishay; Ref Fab: CRCW060310K0FKEA; Coeff: 1; Verification: *; ComponentLink1URL: O:\_Documentation\Datasheets\Vishay\Resistances_D-CRCWe3.pdf; ComponentLink2URL: o:\_Documentation\Datasheets\_BOITIERS\PASSIF_CMS\; Config: *; ComponentLink1Description: Datasheet; ComponentLink2Description: Datasheet Boitier; Supplier 1: Farnell; Supplier 2: RadioSpares; Supplier Part Number 1: 1469748; Supplier Part Number 2: 6789667
R46 = RES_0603_1%_100PPM_7.5K: Résistance, 0.100W, 1%, 100ppm, 75V, 7.5K; Creation: ZA (12/04/13); Boitier: 0603; Remarque: {Remarque}; Fabricant: Vishay; Ref Fab: CRCW06037K50FKEA; Coeff: 1; Verification: *; ComponentLink1URL: o:\_Documentation\Datasheets\Vishay\Resistances_D-CRCWe3.pdf; ComponentLink2URL: o:\_Documentation\Datasheets\_BOITIERS\PASSIF_CMS\; Config: *; ComponentLink1Description: Datasheet; ComponentLink2Description: Datasheet Boitier; Supplier 1: Farnell; Supplier 2: Mouser; Supplier Part Number 1: 1469835; Supplier Part Number 2: 71-CRCW0603-7.5K-E3
R50 R81 = RES_0603_1%_100PPM_10K: Résistance, 0.100W, 1%, 100ppm, 75V, 10K; Creation: JPL (05/07/12); Boitier: 0603; Remarque: {Remarque}; Coeff: 1; Fabricant: Vishay; Ref Fab: CRCW060310K0FKEA; Verification: *; ComponentLink1URL: O:\_Documentation\Datasheets\Vishay\Resistances_D-CRCWe3.pdf; ComponentLink2URL: o:\_Documentation\Datasheets\_BOITIERS\PASSIF_CMS\; Config: *; ComponentLink1Description: Datasheet; ComponentLink2Description: Datasheet Boitier; Supplier 1: Farnell; Supplier Part Number 1: 1469748; Supplier 2: RadioSpares; Supplier Part Number 2: 6789667
R76 = RES_0603_1%_100PPM_51R: as R31 on sheet SDEC944-xD_Ethernet; Verification: *; ComponentLink1URL: O:\_Documentation\Datasheets\Vishay\Resistances_D-CRCWe3.pdf; ComponentLink2URL: o:\_Documentation\Datasheets\_BOITIERS\PASSIF_CMS\; Config: *; ComponentLink1Description: Datasheet; ComponentLink2Description: Datasheet Boitier; Supplier 1: Farnell; Supplier 2: Mouser; Supplier Part Number 1: 1652889; Supplier Part Number 2: 71-CRCW0603-51-E3
T11 T25 = BC847C: Transistor NPN, Vce=50V, Ic=0.1A, hfe=420~800, 0.25W, CMS; Creation: GO (08/07/05); Verification: LJ (21/07/05); Reference: 000329/00; Boitier: SOT23_3L; Remarque: Complementaires aux BC856-860; Fabricant: NXP; Coeff: 1; Ref Fab: BC847C; ComponentLink1URL: O:\_Documentation\Datasheets\NXP\BC847.pdf; ComponentLink2URL: o:\_Documentation\Datasheets\_BOITIERS\ACTIF_CMS\SOT\SOT_23_3P_(Schneider).PDF; Config: *; ComponentLink1Description: Datasheet; Value: BC847C; Supplier 1: Farnell; Supplier Part Number 1: 1081235; ComponentLink2Description: Datasheet Boitier
Title_new#7 = Title_new
U1 = DRV8801PWP: Brushed DC Motor Driver with Current Sense, 2.8A, CMS; Creation: PDP (31/08/12); Boitier: HTSSOP16_PowerPAD (R-PDSO-G16); Remarque: {Remarque}; Fabricant: Texas Instruments; Coeff: 1; Ref Fab: DRV8801PWP; ComponentLink1URL: O:\_Documentation\Datasheets\Texas\drv8801.pdf; ComponentLink2URL: O:\_Documentation\Datasheets\Texas\drv8801.pdf; Config: *; ComponentLink1Description: Datasheet; ComponentLink2Description: Datasheet Boitier; Value: DRV8801PWP; Supplier 1: Mouser; Supplier Part Number 1: 595-DRV8801PWP; Supplier 2: Farnell; Supplier Part Number 2: 1754826
U5 = 74LVC1G57DCKR: Porte logique multifonction, AND/OR/NAND/NOR/XNOR/INV/BUFFER, LVC, CMS SC70_6; Creation: PDP (31/08/2012); Remarque: {Remarque}; Coeff: 1; Fabricant: Texas Instruments; Verification: *; Boitier: SC70_6; ComponentLink1URL: o:\_Documentation\Datasheets\Texas\SN74LVC1G57.pdf; ComponentLink2URL: o:\_Documentation\Datasheets\_Boitiers\ACTIF_CMS\SC\SC70_6_e0,65_(NSC).pdf; Config: *; ComponentLink1Description: Datasheet; ComponentLink2Description: Datasheet Boitier; Ref Fab: SN74LVC1G57DCKR; Supplier 1: Farnell; Supplier Part Number 1: 1470833; Supplier 2: Mouser; Supplier Part Number 2: 595-SN74LVC1G57DCKR
U8 = 74HC1G125GW: Buffer driver de ligne non-inverseur simple, 3 états, CMOS, Picogate, CMS; Creation: PDP (28/09/12); Remarque: {Remarque}; Coeff: 1; Fabricant: NXP; Verification: *; Boitier: SOT353; ComponentLink1URL: o:\_Documentation\Datasheets\NXP\74HC_HCT1G125.pdf; ComponentLink2URL: o:\_Documentation\Datasheets\_Boitiers\ACTIF_CMS\SOT & TSOT\SOT353_5_reflow_(NXP).pdf; Config: *; ComponentLink1Description: Datasheet; ComponentLink2Description: Datasheet Boitier; Ref Fab: 74HC1G125GW; Supplier 1: Mouser; Supplier Part Number 1: 771-74HC1G125GW-G; Supplier 2: Farnell; Supplier Part Number 2: 1867065; Value: 74HC1G125GW
U11 = MCP6L91T-E/OT: Comparateur de tension, simple, Vs=+1.8~5.5V, CMOS, I/O Rail-to-Rail, CMS; Creation: PDP (03/09/2012); Remarque: {Remarque}; Coeff: 1; Fabricant: Microchip; Boitier: SOT23_5L; ComponentLink1URL: O:\_Documentation\Datasheets\MicroChip\MCP6L91R.pdf; ComponentLink2URL: o:\_Documentation\Datasheets\_BOITIERS\ACTIF_CMS\SOT\SOT_23_5P_(Schneider).pdf; Config: *; ComponentLink1Description: Datasheet; ComponentLink2Description: Datasheet Boitier; Ref Fab: MCP6L91T-E/OT; Supplier 1: Mouser; Supplier Part Number 1: 579-MCP6L91T-E/OT; Supplier 2: Farnell; Supplier Part Number 2: 1715865

## Sheet SDEC944-xD_Arrosage_(detect_pluie+commande_vanne).SchDoc: Arrosage (detect pluie+commande vanne)
size 393 x 270 mm; CompanyName: Seccom; Address1: 521, rue du capt. François Garbit; Address2: 69440 Mornant; Address3: seccom@seccom.fr; Address4: www.seccom.fr; DocumentNumber: 13; SheetNumber: 13; SheetTotal: 22; PageSetup: Record=PageOptions|CenterHorizontal=True|CenterVertical=True|PrintScale=0.74|XCorrection=1.00|YCorrection=1.00|PrintKind=0|BorderSize=5000000|LeftOffset=0|BottomOffset=0|Orientation=2|PaperLength=1000|PaperWidth=1000|Scale=100|PaperSource=7|PrintQuality=-4|MediaType=1|DitherType=10|PaperKind=A4|PrintScaleMode=1
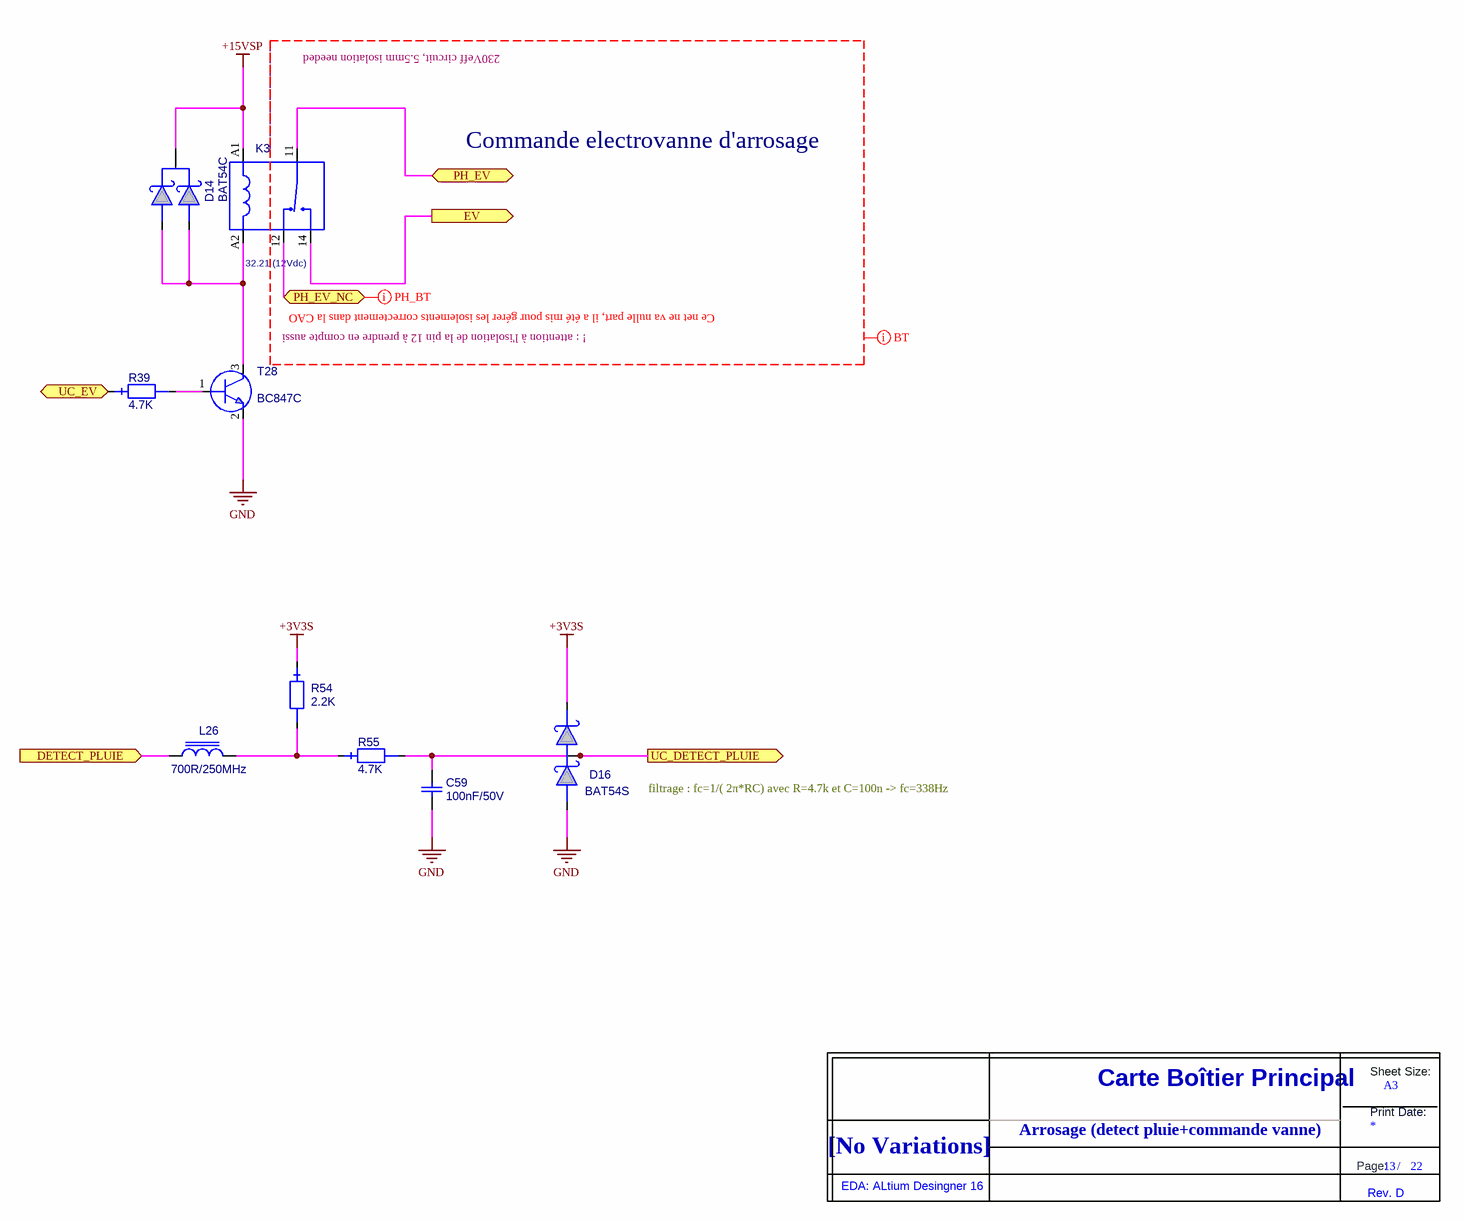
[diagram p7: SDEC944-xD_Arrosage_(detect_pluie+commande_vanne).SchDoc]

### Parts
(Parts that share a designator on the sheet are numbered #1, #2 ... from top to bottom, then left to right.)
C59  value 100nF/50V  [0603_ReflowSoldering_CAP]  (hidden comment: C_0603_X7R_10%_100N-50V)
D14  BAT54C  [SOT23_3L_ReflowSoldering]
D16  BAT54S  [SOT23_3L_ReflowSoldering]
K3  value 32.21 (12Vdc)  [RELAY_FINDER_32.21]  (hidden comment: RELAY_12VDC_1RT_32.21)
L26  value 700R/250MHz  [0603_ReflowSoldering_CAP]  (hidden comment: IND_FERRITE_0603_742792643)
R39  value 4.7K  [0603_ReflowSoldering_RES]  (hidden comment: RES_0603_1%_100PPM_4.7K)
R54  value 2.2K  [0603_ReflowSoldering_RES]  (hidden comment: RES_0603_1%_100PPM_2.2K)
R55  value 4.7K  [0603_ReflowSoldering_RES]  (hidden comment: RES_0603_1%_100PPM_4.7K)
T28  BC847C  [SOT23_3L_ReflowSoldering]
Title_new#8  DNI  (value not drawn)  (graphical)

### Ports
DETECT_PLUIE (in), EV (out), PH_EV (bidir), PH_EV_NC (bidir), UC_DETECT_PLUIE (out), UC_EV (in)

### Nets
+3V3S: D16.2 R54.1
+15VSP: D14.3 K3.A1
GND: C59.2 D16.1 T28.2(E)
DETECT_PLUIE: L26.1 ; port DETECT_PLUIE
EV: K3.14(NO) ; port EV
PH_EV: K3.11(COM) ; port PH_EV
PH_EV_NC: K3.12(NC) ; port PH_EV_NC
UC_DETECT_PLUIE: C59.1 D16.3 R55.2 ; port UC_DETECT_PLUIE
UC_EV: R39.1 ; port UC_EV
NetD14_1: D14.1 D14.2 K3.A2 T28.3(C)
NetL26_2: L26.2 R54.2 R55.1
NetR39_2: R39.2 T28.1(B)

### Layout directives
net class BT: (no net found under the mark)
net class PH_BT: PH_EV_NC

### Notes on the sheet
- 230Veff circuit, 5.5mm isolation needed
- Commande electrovanne d'arrosage
- Ce net ne va nulle part, il a été mis pour gérer les isolements correctement dans la CAO
- ! : attention à l'isolation de la pin 12 à prendre en compte aussi
- filtrage : fc=1/( 2π*RC) avec R=4.7k et C=100n -> fc=338Hz
- Arrosage (detect pluie+commande vanne)
- (in symbol Title_new) Sheet Size:; Carte Boîtier Principal; A3; Print Date:; [No Variations]; Page:; /; EDA: ALtium Desingner 16; Rev. D

### Library data of the parts
C59 = C_0603_X7R_10%_100N-50V: as C60 on sheet SDEC944-xD_Ethernet; ComponentLink1URL: O:\_Documentation\Datasheets\Kemet\Condos_Ceramic_CMS.pdf; ComponentLink2URL: o:\_Documentation\Datasheets\_BOITIERS\PASSIF_CMS\; Config: *; ComponentLink1Description: Datasheet; ComponentLink2Description: Datasheet Boitier; Supplier 1: Farnell; Supplier Part Number 1: 1288255
D14 = BAT54C: Diode Schottky double, BAT54 cathode com, Vrrm=30V, If=300mA, Vf=0.4Vmax, CMS; Creation: LJ (14/05/02); Reference: 000597/00; Boitier: SOT23_3L; Remarque: {Remarque}; Coeff: 1; Fabricant: NXP; Verification: LJ (14/05/02); ComponentLink1URL: O:\_Documentation\Datasheets\NXP\BAT54_series.pdf; ComponentLink2URL: o:\_Documentation\Datasheets\_BOITIERS\ACTIF_CMS\SOT\SOT_23_3P_(Schneider).PDF; Config: *; ComponentLink1Description: Datasheet; ComponentLink2Description: Datasheet Boitier; Ref Fab: BAT54C; Supplier 1: Farnell; Supplier Part Number 1: 1081192; Value: BAT54C
D16 = BAT54S: Diode Schottky double, BAT54 en série, Vrrm=30V, If=200mA, Vf=0.4Vmax, CMS; Creation: JMP 05/09/2002; Verification: GO (26/09/02); Reference: 000206/00; Boitier: SOT23_3L; Remarque: {Remarque}; Coeff: 1; Fabricant: NXP; ComponentLink1URL: O:\_Documentation\Datasheets\NXP\BAT54_series.pdf; ComponentLink2URL: o:\_Documentation\Datasheets\_BOITIERS\ACTIF_CMS\SOT\SOT_23_3P_(Schneider).PDF; Config: *; ComponentLink1Description: Datasheet; ComponentLink2Description: Datasheet Boitier; Ref Fab: BAT54S; Supplier 1: Farnell; Supplier Part Number 1: 1081194; Value: BAT54S; Supplier 2: Mouser; Supplier Part Number 2: 771-BAT54S-T/R
K3 = RELAY_12VDC_1RT_32.21: Relais 1RT, 12Vdc, série 32.21, Rc=720R, Sw:250Vac/6A, Ron=? (AgCdO); Creation: CHD (21/03/12); Boitier: 20x10x10.7mm; Remarque: {Remarque}; Fabricant: Finder; Ref Fab: 32.21.7.012.2000; Coeff: 1; ComponentLink1URL: O:\_Documentation\Datasheets\Finder\Relais_Serie_32.pdf; ComponentLink2URL: o:\_Documentation\Datasheets\Finder\; Config: *; ComponentLink1Description: Datasheet; ComponentLink2Description: Datasheet Boitier; Supplier 1: Farnell; Supplier Part Number 1: 1329652
L26 = IND_FERRITE_0603_742792643: as L27 on sheet SDEC944-xD_Ethernet; ComponentLink1URL: o:\_Documentation\Datasheets\Murata\Ferrite_BLM21P.pdf; Config: *; ComponentLink1Description: Datasheet; ComponentLink2Description: Datasheet Boitier; Ref Fab: 742792643; Supplier 1: Farnell; Supplier Part Number 1: 1800349
R39 R55 = RES_0603_1%_100PPM_4.7K: as R71 on sheet SDEC944-xD_Ethernet; Verification: *; ComponentLink1URL: O:\_Documentation\Datasheets\Vishay\Resistances_D-CRCWe3.pdf; ComponentLink2URL: o:\_Documentation\Datasheets\_BOITIERS\PASSIF_CMS\; Config: *; ComponentLink1Description: Datasheet; ComponentLink2Description: Datasheet Boitier; Supplier 1: Farnell; Supplier 2: RadioSpares; Supplier Part Number 1: 1469807; Supplier Part Number 2: 6790484
R54 = RES_0603_1%_100PPM_2.2K: Résistance, 0.100W, 1%, 100ppm, 75V, 2.2K; Creation: JPL (05/07/12); Boitier: 0603; Remarque: {Remarque}; Fabricant: Vishay; Ref Fab: CRCW06032K20FKEA; Coeff: 1; Verification: *; ComponentLink1URL: O:\_Documentation\Datasheets\Vishay\Resistances_D-CRCWe3.pdf; ComponentLink2URL: o:\_Documentation\Datasheets\_BOITIERS\PASSIF_CMS\; Config: *; ComponentLink1Description: Datasheet; ComponentLink2Description: Datasheet Boitier; Supplier 1: Farnell; Supplier 2: RadioSpares; Supplier Part Number 1: 1469765; Supplier Part Number 2: 6790112
T28 = BC847C: as T11 on sheet SDEC944-xD_Liaison_IHM; Ref Fab: BC847C; ComponentLink1URL: O:\_Documentation\Datasheets\NXP\BC847.pdf; ComponentLink2URL: o:\_Documentation\Datasheets\_BOITIERS\ACTIF_CMS\SOT\SOT_23_3P_(Schneider).PDF; Config: *; ComponentLink1Description: Datasheet; Value: BC847C; Supplier 1: Farnell; Supplier Part Number 1: 1081235; ComponentLink2Description: Datasheet Boitier
Title_new#8 = Title_new